# EAGLE design SimpleEXGCircuit (EAGLE 8.3.2)
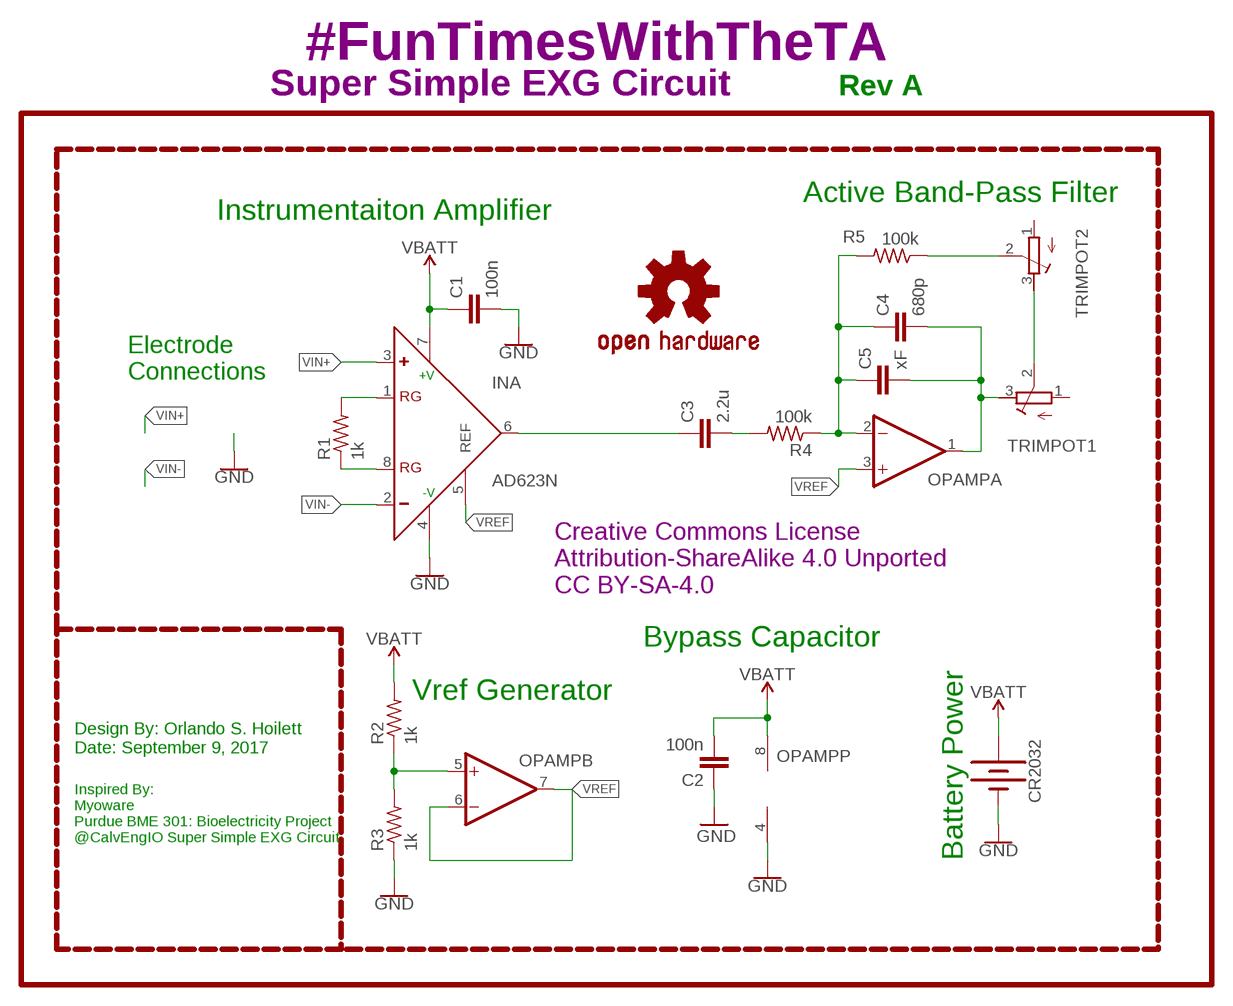
[diagram p0: schematic, sheet 1]

## Parts
C1  100n  CAPACITORC050-030X075  [C050-030X075]
C2  100n  CAPACITORC050-030X075  [C050-030X075]
C3  2.2u  CAPACITORC050-030X075  [C050-030X075]
C4  680p  CAPACITORC050-030X075  [C050-030X075]
C5  xF  CAPACITORC050-030X075  [C050-030X075]
CR2032  BATTERY-20MM_SMD_4LEGS_OVERPASTE  [BATTCON_20MM_4LEGS_OVERPASTE]
INA  AD623N  [DIL08]
LOGO1  OSHW-LOGOS  [OSHW-LOGO-S]
OPAMP  OP-DUALDIP08  [DIL08]
R1  1k  RESISTOR0207/10  [0207/10]
R2  1k  RESISTOR0207/10  [0207/10]
R3  1k  RESISTOR0207/10  [0207/10]
R4  100k  RESISTOR0207/10  [0207/10]
R5  100k  RESISTOR0207/10  [0207/10]
TRIMPOT1  TRIM-POT-P160  [16MMROTARYPOT]
TRIMPOT2  TRIM-POT-P160  [16MMROTARYPOT]

## Nets
GND: C1.2 C2.1 CR2032.2(-) INA.4(-V) OPAMP.4(P:V-) R3.1
N$1: R5.1 TRIMPOT2.2(S)
N$2: TRIMPOT1.2(S) TRIMPOT2.3(E)
N$3: OPAMP.5(B:+IN) R2.1 R3.2
N$4: C3.2 R4.2
N$5: C4.1 C5.1 OPAMP.2(A:-IN) R4.1 R5.2
N$7: C3.1 INA.6(OUT)
N$9: INA.1(RG) R1.2
N$10: INA.8(RG) R1.1
OUT: C4.2 C5.2 OPAMP.1(A:OUT) TRIMPOT1.3(E)
V_BATT: C1.1 C2.2 CR2032.1(+) INA.7(+V) OPAMP.8(P:V+) R2.2 ; supply symbol labelled VBATT
VIN+: INA.3(+)
VIN-: INA.2(-)
VREF: INA.5(REF) OPAMP.3(A:+IN) OPAMP.6(B:-IN) OPAMP.7(B:OUT)
Unconnected: TRIMPOT1.1(A) TRIMPOT2.1(A)

## Notes on the sheet
- #FunTimesWithTheTA
- Super Simple EXG Circuit | Rev A
- Active Band-Pass Filter
- Instrumentaiton Amplifier
- Electrode
  Connections
- Creative Commons License
  Attribution-ShareAlike 4.0 Unported
  CC BY-SA-4.0
- Bypass Capacitor
- Vref Generator
- Design By: Orlando S. Hoilett
  Date: September 9, 2017
- Inspired By:
  Myoware
  Purdue BME 301: Bioelectricity Project
  @CalvEngIO Super Simple EXG Circuit
- Battery Power

## Library data of the parts
C1-C5 = CalvEngIO-Passives:CAPACITOR
CR2032 = CalvEngIO-Connectors:BATTERY: Battery - Single Cell A variety of battery chemistries, sizes, and footprints. Device List: 20MM_PTH - Coin Cell Battery Holder - 20mm (PTH) <https://www.sparkfun.com/products/783> 6.8MM_PTH - Coin Cell Battery Holder - 6.8MM(SMD) <https://www.digikey.com/product-detail/en/seiko-instruments/MS621FE-FL11E/728-1057-ND/1889208?WT.srch=1&gclid=CNOQ5a6LzdQCFZS2wAodXCkE0g> 12MM_SMD - Coin Cell Battery Holder - 12mm (SMD) <https://www.sparkfun.com/products/10592> 12MM_PTH - Coin Cell Battery Holder - 12mm (PTH) <https://www.sparkfun.com/products/7948> 20MM_SMD - 20mm Coin Cell Battery Holder (SMD) (2 legs) Used on the Big Time Watch Kit <https://www.sparkfun.com/products/11734> 20MM_SMD_4LEGS - Coin Cell Battery Holder - 20mm (SMD) <https://www.sparkfun.com/products/11892> 20MM_SMD_4LEGS_OVERPASTE - Coin Cell Battery Holder - 20mm (SMD) <https://www.sparkfun.com/products/11892> (Over-paste on the legs) 24.5MM_PTH - Coin Cell Battery Holder - 24.5mm (PTH) <https://www.sparkfun.com/products/8863> 9V - 9V Battery Holder - PC Mount Used on the SparkFun SparkPunk Sound Kit <https://www.sparkfun.com/products/11177> and SparkFun SparkPunk Sequencer Kit <https://www.sparkfun.com/products/12707> 18650 - Battery Holder - 18650 (PTH) <https://www.sparkfun.com/products/13113> AA - Battery Holder - 1xAA (PTH) <https://www.sparkfun.com/products/7949> AAA - Battery Holder - 1xAAA (PTH) <https://www.sparkfun.com/products/12718> AA_KIT - Battery Holder - 1xAA (PTH) <https://www.sparkfun.com/products/7949> Special kit package - pads only have exposed copper on one side of the board. AAA_KIT - Battery Holder - 1xAAA (PTH) <https://www.sparkfun.com/products/12718> Special kit package - pads only have exposed copper on one side of the board.; PROD_ID: PRT-11892; SF_SKU: BATT-10373
INA = CalvEngIO-AnalogIC:AD623: Single-Supply, Rail-to-Rail, Low Cost Instrumentation Amplifier Source: http://www.analog.com/static/imported-files/data_sheets/AD623.pdf; MF: ALTERA CORPORATION; MPN: AD623ANZ; OC_FARNELL: 9603700; OC_NEWARK: 59K4402
LOGO1 = SparkFun-Aesthetics:OSHW-LOGO: Open Source Hardware Logo This logo indicates the piece of hardware it is found on incorporates a OSHW license and/or adheres to the definition of open source hardware found here: http://freedomdefined.org/OSHW
OPAMP = CalvEngIO-AnalogIC:OP-DUAL: Precision Micropower, Low Noise CMOS, Rail-to-Rail Input/Output Operational Amplifiers Source: http://www.analog.com/static/imported-files/data_sheets/AD8603_8607_8609.pdf
R1-R5 = CalvEngIO-Passives:RESISTOR
TRIMPOT1 TRIMPOT2 = CalvEngIO-Passives:TRIM-POT-P160

## Board
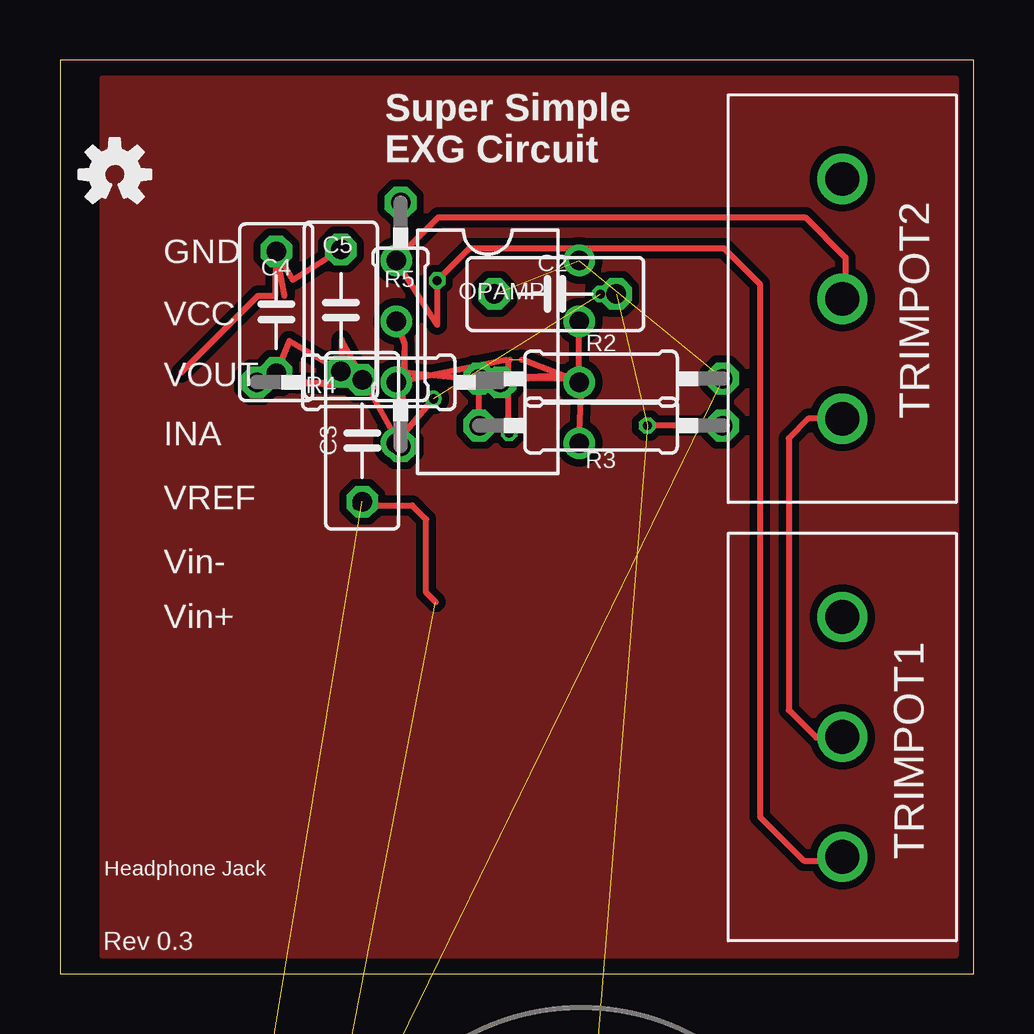
[diagram p1: board, top side]
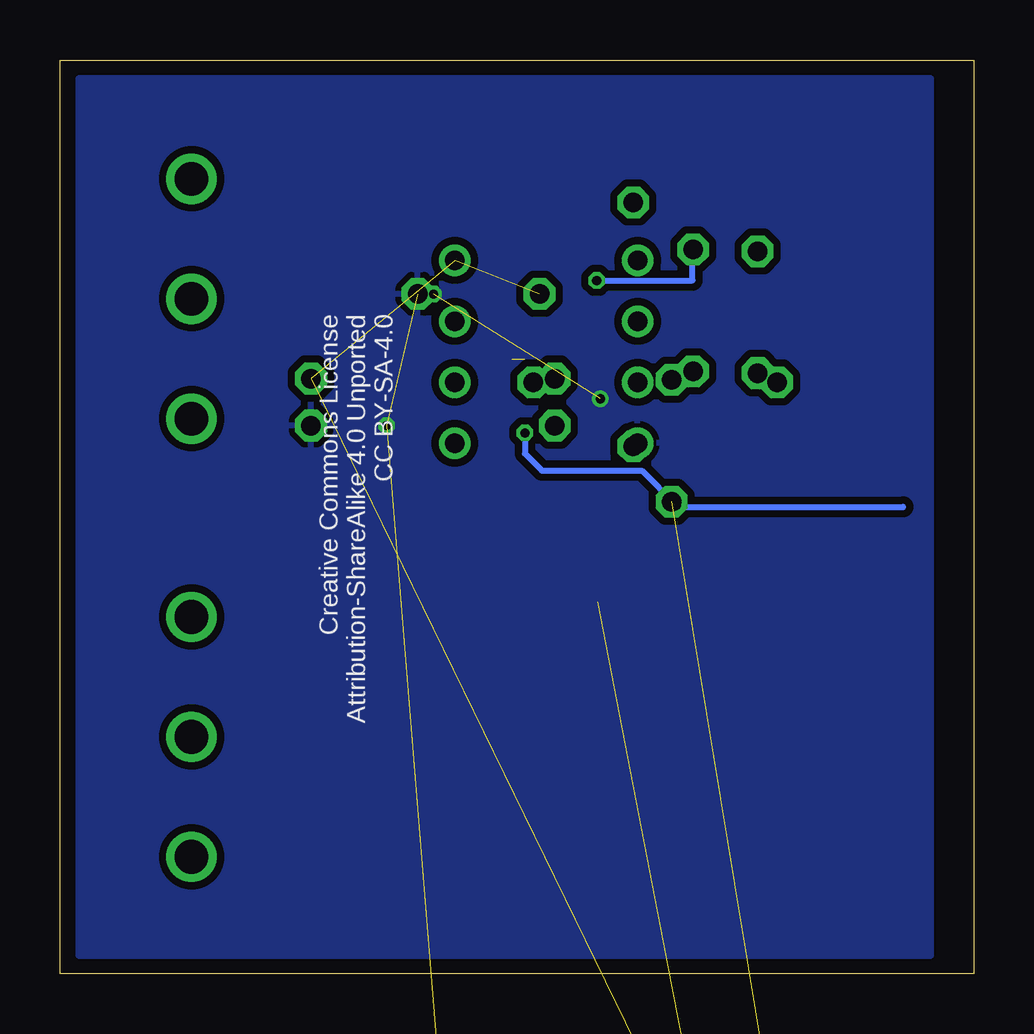
[diagram p2: board, bottom side, seen from below]

Size 38.1 x 38.1 mm. Coordinates in mm from the lower left corner, seen from the top.
Outline: 0,0 38.1,0 38.1,38.1 0,38.1 0,0
Copper layers (1*16): Top 0.035mm / dielectric 1.5mm / Bottom 0.035mm
Design rules "SeeedStudio_2layer_DRU_no_angle_20140221": minimum track width 6mil, minimum drill 12mil, track to track 6mil, track to pad 6mil, pad to pad 6mil, via to via 6mil, smd to smd 0mil, copper to edge 10mil, drill to drill 10mil, minimum pad ring 10mil, minimum via ring 6mil, stop-mask expansion 2mil, vias tented up to drill 100mil, thermal gap 10mil

### Footprints (pad centres in the part's own frame; a part is rotated, then mirrored left to right if it is on the bottom)
C050-030X075 = drill 0.813 octagon: 1 -2.54,0; 2 2.54,0
BATTCON_20MM_4LEGS_OVERPASTE = smd 1.778 x 2.54: 1 -11,1.55; 3 11,1.55; P$1 -11,-1.55; P$2 11,-1.55 | smd 13 x 8: 2 0,0
DIL08 = drill 0.813 pad 1.27: 1 -3.81,-3.81; 2 -1.27,-3.81; 3 1.27,-3.81; 4 3.81,-3.81; 5 3.81,3.81; 6 1.27,3.81; 7 -1.27,3.81; 8 -3.81,3.81
0207/10 = drill 0.813 octagon: 1 -5.08,0; 2 5.08,0
16MMROTARYPOT = drill 1.4: 1 -5,0; 2 0,0; 3 5,0

### Placement (x,y rotation side)
C1  2.18,-62.15 0 top  (outside the outline)
C2  20.65,28.35 180 top
C3  12.6,22.23 90 top
C4  9.02,27.58 90 top
C5  11.71,27.66 90 top
CR2032  21.72,-11.4 0 top  (outside the outline)
INA  3.45,-31.93 0 top  (outside the outline)
LOGO1  2.29,33.32 0 top
OPAMP  17.83,25.93 270 top
R1  4.72,-48.95 0 top  (outside the outline)
R2  22.56,24.82 0 top
R3  22.56,22.86 180 top
R4  13.28,24.66 180 top
R5  14.2,27.08 270 top
TRIMPOT1  32.61,9.88 270 top
TRIMPOT2  32.61,28.14 270 top

### Tracks (layer width: path | path; a pad name or v marks a point on that pad's centre or on a via)
GND  (via drill 0.38)  (5 unrouted)
  Top 0.254: C2.1 v22.53,28.35 | R3.1 v24.49,22.86 | OPAMP.4 v15.57,23.98
  pour Bottom (isolate 0.305): 1.78,37.34 37.34,37.34 37.34,0.76 1.78,0.76
N$1
  Top 0.254: TRIMPOT2.2 32.74,28.27 32.74,29.87 31.06,31.55 15.77,31.55 14.2,29.97 R5.1
N$2
  Top 0.254: TRIMPOT2.3 31.2,23.14 30.38,22.33 30.38,11 31.52,9.86 32.59,9.86 TRIMPOT1.2
N$3
  Top 0.254: OPAMP.5 21.76,24.96 R2.1 | 21.89,24.8 R2.1 | R3.2 R2.1
N$4
  Top 0.254: 12.6,24.5 R4.2 12.6,24.63 C3.2
N$5
  Top 0.254: C4.1 9.56,26.39 C5.1 11.74,26.43 R5.2 14.37,26.26 | 14.37,26.26 14.37,25.09 R4.1 | OPAMP.2 14.37,26.26
N$7  (1 unrouted)
N$9  (1 unrouted)
N$10  (1 unrouted)
OUT  (via drill 0.38)
  Top 0.254: TRIMPOT1.3 32.46,4.72 31.01,4.72 29.18,6.55 29.18,28.75 27.69,30.25 17.07,30.25 v15.72,28.91 15.72,27.06 OPAMP.1 | C5.2 9.71,28.93 C4.2 | 5.05,25.07 8.26,28.27 8.98,28.27 C4.2 | 9.36,28.27 C4.2
  Bottom 0.254: v15.72,28.91 11.73,28.91 C5.2
V_BATT  (5 unrouted)
VCC
  pour Top (isolate 0.305): 1.78,37.34 37.34,37.34 37.34,0.76 1.78,0.76
VREF  (via drill 0.38)  (2 unrouted)
  Top 0.254: 18.67,25.53 18.67,22.61 v18.72,22.55 | 18.67,25.53 18.75,25.61 | 15.67,15.5 15.27,15.9 15.27,18.95 14.68,19.53 v12.39,19.53 | OPAMP.3 18.59,25.61 18.67,25.53 | OPAMP.7 OPAMP.6 19.26,25.61
  Bottom 0.254: v18.72,22.55 18.72,21.69 18.01,20.98 13.84,20.98 v12.39,19.53 12.32,19.46 2.95,19.46 2.95,19.48

### Text on the board
tNames: Super Simple / EXG Circuit | GND | VCC | VOUT | INA | VREF | Vin- | Vin+ | Headphone Jack | Rev 0.3
_bsilk: Creative Commons License / Attribution-ShareAlike 4.0 Unported / CC BY-SA-4.0